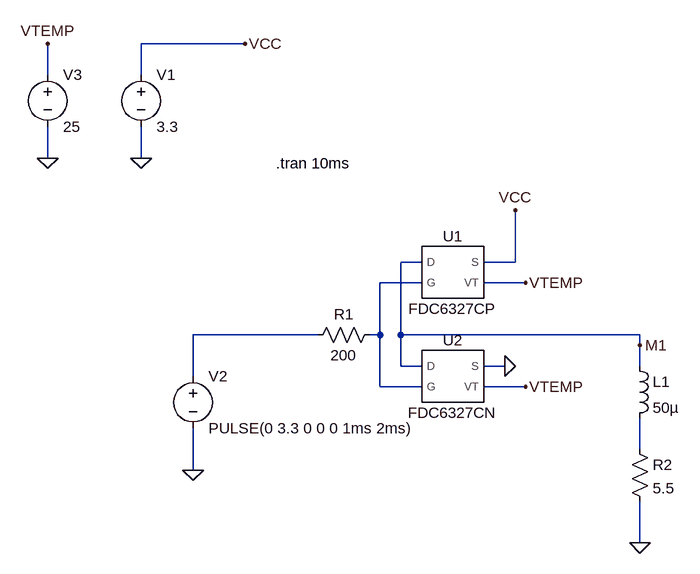
[diagram p0: schematic Dual N & P MOSFET.asc]
Dual N & P MOSFET.asc, the LTspice schematic file:
Version 4
SHEET 1 880 680
WIRE 64 -128 -96 -128
WIRE -240 -80 -240 -128
WIRE -96 -80 -96 -128
WIRE -240 48 -240 0
WIRE -96 48 -96 0
WIRE 336 208 304 208
WIRE 480 208 480 128
WIRE 480 208 432 208
WIRE 336 240 272 240
WIRE 496 240 432 240
WIRE 176 320 -16 320
WIRE 272 320 272 240
WIRE 272 320 256 320
WIRE 304 320 304 208
WIRE 672 320 304 320
WIRE 672 336 672 320
WIRE 304 368 304 320
WIRE 336 368 304 368
WIRE 464 368 432 368
WIRE 672 368 672 336
WIRE -16 384 -16 320
WIRE 272 400 272 320
WIRE 336 400 272 400
WIRE 496 400 432 400
WIRE 672 496 672 448
WIRE -16 528 -16 464
WIRE 672 640 672 576
FLAG 464 368 0
FLAG 480 128 VCC
FLAG -96 48 0
FLAG -16 528 0
FLAG 64 -128 VCC
FLAG 672 336 M1
FLAG -240 48 0
FLAG -240 -128 VTEMP
FLAG 496 240 VTEMP
FLAG 496 400 VTEMP
FLAG 672 640 0
SYMBOL FDC6327CP 384 224 R0
SYMATTR InstName U1
SYMBOL FDC6327CN 384 384 R0
SYMATTR InstName U2
SYMBOL res 272 304 R90
WINDOW 0 0 56 VBottom 2
WINDOW 3 32 56 VTop 2
SYMATTR InstName R1
SYMATTR Value 200
SYMBOL voltage -96 -96 R0
SYMATTR InstName V1
SYMATTR Value 3.3
SYMBOL voltage -16 368 R0
SYMATTR InstName V2
SYMATTR Value PULSE(0 3.3 0 0 0 1ms 2ms)
SYMBOL voltage -240 -96 R0
SYMATTR InstName V3
SYMATTR Value 25
SYMBOL ind 656 352 R0
SYMATTR InstName L1
SYMATTR Value 50µ
SYMBOL res 656 480 R0
SYMATTR InstName R2
SYMATTR Value 5.5
TEXT 112 56 Left 2 !.tran 10ms

The netlist it stands for:
* Dual N & P MOSFET.asc
XU1 M1 N001 VCC VTEMP FDC6327CP  ; pins D G S VT
XU2 M1 N001 0 VTEMP FDC6327CN  ; pins D G S VT
R1 N001 N002 200
V1 VCC 0 3.3
V2 N002 0 PULSE(0 3.3 0 0 0 1ms 2ms)
V3 VTEMP 0 25
L1 M1 N003 50µ
R2 N003 0 5.5
.tran 10ms
.lib /Users/johanwestlund/Downloads/FDC6327C.mod
.backanno
.end